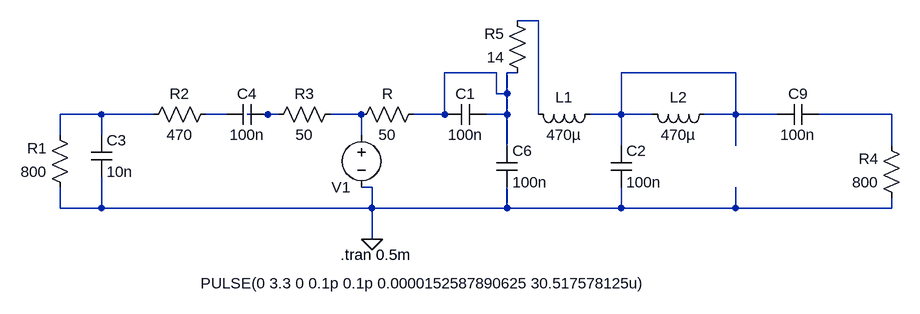
[diagram p0: schematic Xtal_fliter.asc]
Xtal_fliter.asc, the LTspice schematic file:
Version 4
SHEET 1 1524 680
WIRE 368 -48 336 -48
WIRE 304 32 224 32
WIRE 336 32 320 32
WIRE 672 32 496 32
WIRE 304 64 304 32
WIRE 320 64 320 32
WIRE 320 64 304 64
WIRE -304 96 -368 96
WIRE -224 96 -304 96
WIRE -112 96 -144 96
WIRE -48 96 -80 96
WIRE -32 96 -48 96
WIRE 96 96 48 96
WIRE 224 96 224 32
WIRE 224 96 176 96
WIRE 320 96 320 64
WIRE 320 96 288 96
WIRE 368 96 368 -48
WIRE 496 96 496 32
WIRE 496 96 448 96
WIRE 544 96 496 96
WIRE 672 96 672 32
WIRE 672 96 624 96
WIRE 736 96 672 96
WIRE 912 96 800 96
WIRE -368 128 -368 96
WIRE -304 128 -304 96
WIRE 96 128 96 96
WIRE 320 144 320 96
WIRE 496 144 496 96
WIRE 672 144 672 96
WIRE 912 144 912 96
WIRE 112 208 96 208
WIRE -368 240 -368 208
WIRE -304 240 -304 192
WIRE -304 240 -368 240
WIRE 112 240 112 208
WIRE 112 240 -304 240
WIRE 320 240 320 208
WIRE 320 240 112 240
WIRE 496 240 496 208
WIRE 496 240 320 240
WIRE 672 240 672 208
WIRE 672 240 496 240
WIRE 912 240 912 224
WIRE 912 240 672 240
WIRE 112 288 112 240
FLAG 112 288 0
SYMBOL voltage 96 112 R0
WINDOW 0 -46 96 Left 2
WINDOW 3 -248 244 Left 2
WINDOW 123 0 0 Left 0
WINDOW 39 0 0 Left 0
SYMATTR InstName V1
SYMATTR Value PULSE(0 3.3 0 0.1p 0.1p 0.0000152587890625 30.517578125u)
SYMBOL res 192 80 R90
WINDOW 0 0 56 VBottom 2
WINDOW 3 32 56 VTop 2
SYMATTR InstName R
SYMATTR Value 50
SYMBOL cap -320 128 R0
SYMATTR InstName C3
SYMATTR Value 10n
SYMBOL res -128 80 R90
WINDOW 0 0 56 VBottom 2
WINDOW 3 32 56 VTop 2
SYMATTR InstName R2
SYMATTR Value 470
SYMBOL res 64 80 R90
WINDOW 0 0 56 VBottom 2
WINDOW 3 32 56 VTop 2
SYMATTR InstName R3
SYMATTR Value 50
SYMBOL cap -48 80 R90
WINDOW 0 0 32 VBottom 2
WINDOW 3 32 32 VTop 2
SYMATTR InstName C4
SYMATTR Value 100n
SYMBOL cap 288 80 R90
WINDOW 0 0 32 VBottom 2
WINDOW 3 32 32 VTop 2
SYMATTR InstName C1
SYMATTR Value 100n
SYMBOL cap 480 144 R0
SYMATTR InstName C2
SYMATTR Value 100n
SYMBOL cap 304 144 R0
SYMATTR InstName C6
SYMATTR Value 100n
SYMBOL ind 464 80 R90
WINDOW 0 5 56 VBottom 2
WINDOW 3 32 56 VTop 2
SYMATTR InstName L1
SYMATTR Value 470µ
SYMBOL ind 640 80 R90
WINDOW 0 5 56 VBottom 2
WINDOW 3 32 56 VTop 2
SYMATTR InstName L2
SYMATTR Value 470µ
SYMBOL res 928 240 R180
WINDOW 0 36 76 Left 2
WINDOW 3 36 40 Left 2
SYMATTR InstName R4
SYMATTR Value 800
SYMBOL cap 800 80 R90
WINDOW 0 0 32 VBottom 2
WINDOW 3 32 32 VTop 2
SYMATTR InstName C9
SYMATTR Value 100n
SYMBOL res -352 224 R180
WINDOW 0 36 76 Left 2
WINDOW 3 36 40 Left 2
SYMATTR InstName R1
SYMATTR Value 800
SYMBOL res 352 48 R180
WINDOW 0 36 76 Left 2
WINDOW 3 36 40 Left 2
SYMATTR InstName R5
SYMATTR Value 14
TEXT 64 312 Left 2 !.tran 0.5m

The netlist it stands for:
* Xtal_fliter.asc
V1 N007 0 PULSE(0 3.3 0 0.1p 0.1p 0.0000152587890625 30.517578125u)
R N002 N007 50
C3 N004 0 10n
R2 N005 N004 470
R3 N007 N006 50
C4 N006 N005 100n
C1 N002 N002 100n
C2 N003 0 100n
C6 N002 0 100n
L1 N003 N001 470µ
L2 N003 N003 470µ
R4 0 N008 800
C9 N008 N003 100n
R1 0 N004 800
R5 N002 N001 14
.tran 0.5m
.backanno
.end